# EAGLE design Encoder (EAGLE 8.6.3)
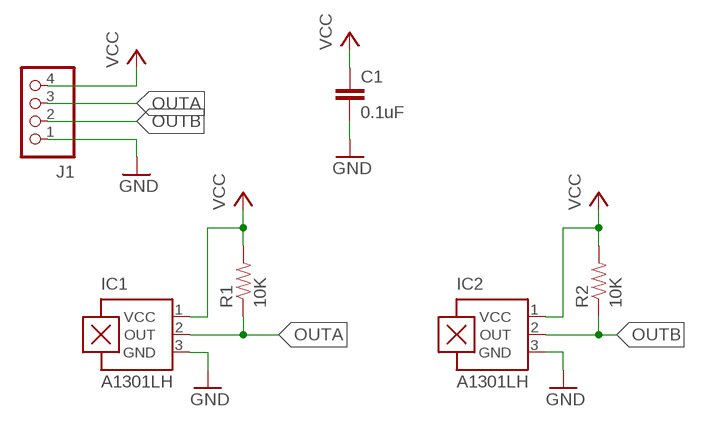
[diagram p0: schematic, sheet 1]

## Parts
C1  0.1uF  CAP0603-CAP  [0603-CAP]
IC1  A1301LH  [SOT23-W]
IC2  A1301LH  [SOT23-W]
J1  B4B-PH-K-S  [B4B-PH-K-S]
R1  10K  RESISTOR0603  [0603-RES]
R2  10K  RESISTOR0603  [0603-RES]

## Nets
GND: C1.2 IC1.3(GND) IC2.3(GND) J1.1
OUTA: IC1.2(OUT) J1.3 R1.1
OUTB: IC2.2(OUT) J1.2 R2.1
VCC: C1.1 IC1.1(VCC) IC2.1(VCC) J1.4 R1.2 R2.2

## Library data of the parts
C1 = SparkFun-Capacitors:CAP: Capacitor Standard 0603 ceramic capacitor, and 0.1" leaded capacitor.
IC1 IC2 = allegro:A13*?: Linear Hall Effect Sensor ICs Continuous-Time Ratiometric High-Temperature Operation Programmable Linear with Analog Output A1302 -Replacement- UGN3503 Source: http://www.allegromicro.com/en/Products/Part_Numbers/1301/1301.pdf http://www.allegromicro.com/en/Products/Part_Numbers/1321/1321.pdf http://www.allegromicro.com/en/Products/Part_Numbers/1381/1381.pdf; MF: ALLEGRO MICROSYSTEMS, INC.; MPN: A1301ELHLT-T; OC_FARNELL: 1198084; OC_NEWARK: 31K6634
J1 = jst-ph:B4B-PH-*: Wire-to-Board 2.0mm pitch top mount connector Source: http://www.jst-mfg.com/product/pdf/jpn/PH.pdf http://www.jst-mfg.com/product/detail.php?series=199
R1 R2 = SparkFun-Resistors:RESISTOR: Resistor Basic schematic elements and footprints for 0603, 1206, and PTH resistors.

## Board
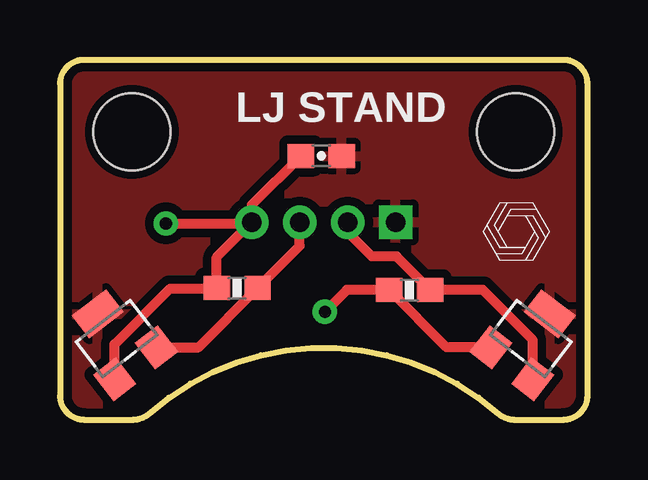
[diagram p1: board, top side]
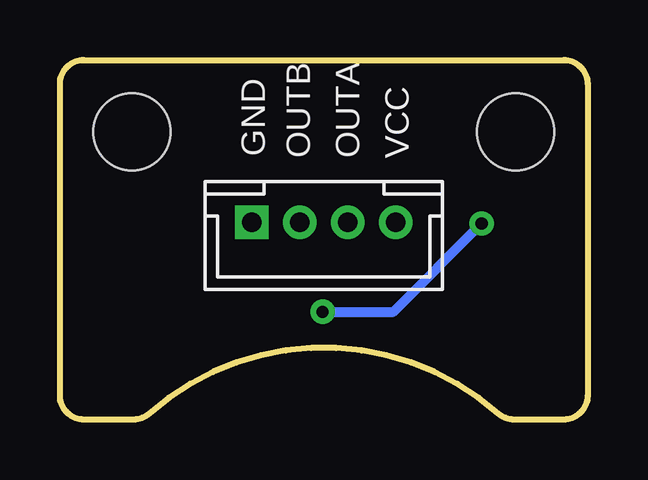
[diagram p2: board, bottom side, seen from below]

Size 22 x 15 mm. Coordinates in mm from the lower left corner, seen from the top.
Outline: 22,1 22,14 arc90 21,15 1,15 arc90 0,14 0,1 arc90 1,0 3.06,0 arc41 3.72,0.25 arc-83 18.28,0.25 arc41 18.94,0 21,0 arc90 22,1
Copper layers (1*16): Top 0.035mm / dielectric 1.5mm / Bottom 0.035mm
Design rules "SparkFun": minimum track width 8mil, minimum drill 20mil, track to track 8mil, track to pad 8mil, pad to pad 8mil, via to via 8mil, smd to smd 8mil, copper to edge 10mil, drill to drill 8mil, minimum pad ring 12mil, minimum via ring 10mil, stop-mask expansion 4mil, vias tented up to drill 25mil, thermal gap 10mil
Holes 3.2 mm at 19,12 3,12

### Footprints (pad centres in the part's own frame; a part is rotated, then mirrored left to right if it is on the bottom)
0603-CAP = smd 1.1 x 1: 1 -0.85,0; 2 0.85,0
SOT23-W = smd 1.2 x 1.4: 1 -1.1,-1.3; 2 1.1,-1.3 | smd 1.8 x 1.2: 3 0,1.3
B4B-PH-K-S = drill 0.8 square: 1 -3,0 | drill 0.8: 2 -1,0; 3 1,0; 4 3,0
0603-RES = smd 1.1 x 1: 1 -0.85,0; 2 0.85,0

### Placement (x,y rotation side)
C1  10.9,11 0 top
IC1  2.36,3.38 37.5 top
IC2  19.63,3.38 322.5 top
J1  11,8.23 0 bottom
R1  7.39,5.49 180 top
R2  14.58,5.41 180 top

### Tracks (layer width: path | path; a pad name or v marks a point on that pad's centre or on a via)
GND
  pour Top (isolate 0.356): -3.17,17.78 -3.17,-3.17 26.04,-3.17 26.04,17.78
OUTA
  Top 0.406: IC1.2 5.77,3.02 R1.1 10,7.24 J1.3
OUTB
  Top 0.406: IC2.2 19.71,3.32 17.63,5.41 R2.1 14.03,6.81 13.01,6.81 12,7.81 J1.2
VCC  (via drill 0.51)
  Top 0.406: IC1.1 2.28,3.14 4.6,5.46 6.52,5.46 R1.2 6.54,6.77 J1.4 | IC2.1 16.12,3.02 R2.2 11.96,5.41 v11.05,4.5 | C1.1 8,8.95 J1.4 | v4.42,8.18 7.95,8.18 J1.4
  Bottom 0.406: v11.05,4.5 8.1,4.5 v4.42,8.18

### Text on the board
tPlace: LJ STAND
bPlace: VCC | OUTA | OUTB | GND